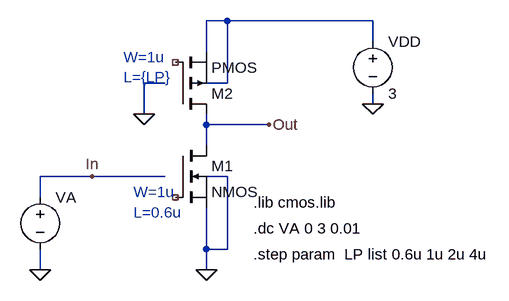
[diagram p0: schematic invdc.asc]
invdc.asc, the LTspice schematic file:
Version 4
SHEET 1 1292 680
WIRE -592 -96 -624 -96
WIRE -368 -96 -592 -96
WIRE -368 -64 -368 -96
WIRE -624 -48 -624 -96
WIRE -688 0 -720 0
WIRE -592 0 -592 -96
WIRE -592 0 -624 0
WIRE -368 32 -368 16
WIRE -720 48 -720 0
WIRE -624 64 -624 48
WIRE -528 64 -624 64
WIRE -624 96 -624 64
WIRE -800 144 -880 144
WIRE -688 144 -800 144
WIRE -592 144 -624 144
WIRE -880 176 -880 144
WIRE -624 256 -624 192
WIRE -592 256 -592 144
WIRE -592 256 -624 256
WIRE -880 288 -880 256
WIRE -624 288 -624 256
FLAG -624 288 0
FLAG -368 32 0
FLAG -800 144 In
FLAG -528 64 Out
FLAG -880 288 0
FLAG -720 48 0
SYMBOL voltage -368 -80 R0
WINDOW 123 0 0 Left 2
WINDOW 39 0 0 Left 2
SYMATTR InstName VDD
SYMATTR Value 3
SYMBOL voltage -880 160 R0
WINDOW 123 0 0 Left 2
WINDOW 39 0 0 Left 2
SYMATTR InstName VA
SYMATTR Value ""
SYMBOL pmos -672 48 M180
WINDOW 39 56 100 Left 2
WINDOW 40 56 128 Left 2
SYMATTR InstName M2
SYMATTR Value2 l={LP} w=1u
SYMATTR SpiceModel ""
SYMATTR Value PMOS
SYMBOL nmos -672 96 R0
SYMATTR InstName M1
SYMATTR Value2 l=0.6u w=1u
SYMATTR SpiceModel ""
SYMATTR Value NMOS
TEXT -552 184 Left 2 !.lib cmos.lib
TEXT -552 224 Left 2 !.dc VA 0 3 0.01
TEXT -552 264 Left 2 !.step param  LP list 0.6u 1u 2u 4u
TEXT -752 -40 Left 2 ;W=1u\nL={LP}
TEXT -736 168 Left 2 ;W=1u\nL=0.6u

The netlist it stands for:
* invdc.asc
VDD N001 0 3
VA In 0
* M2: PMOS l={LP} w=1u (symbol pmos not certain, pin order unknown); nets seen at it: N001, Out
* M1: NMOS l=0.6u w=1u (symbol nmos not certain, pin order unknown); nets seen at it: 0, Out
.lib cmos.lib
.dc VA 0 3 0.01
.step param  LP list 0.6u 1u 2u 4u
* W=1u
* L={LP}
* W=1u
* L=0.6u
.backanno
.end